# EAGLE design envlogger (EAGLE 9.6.1)

## Sheet 1 of 4
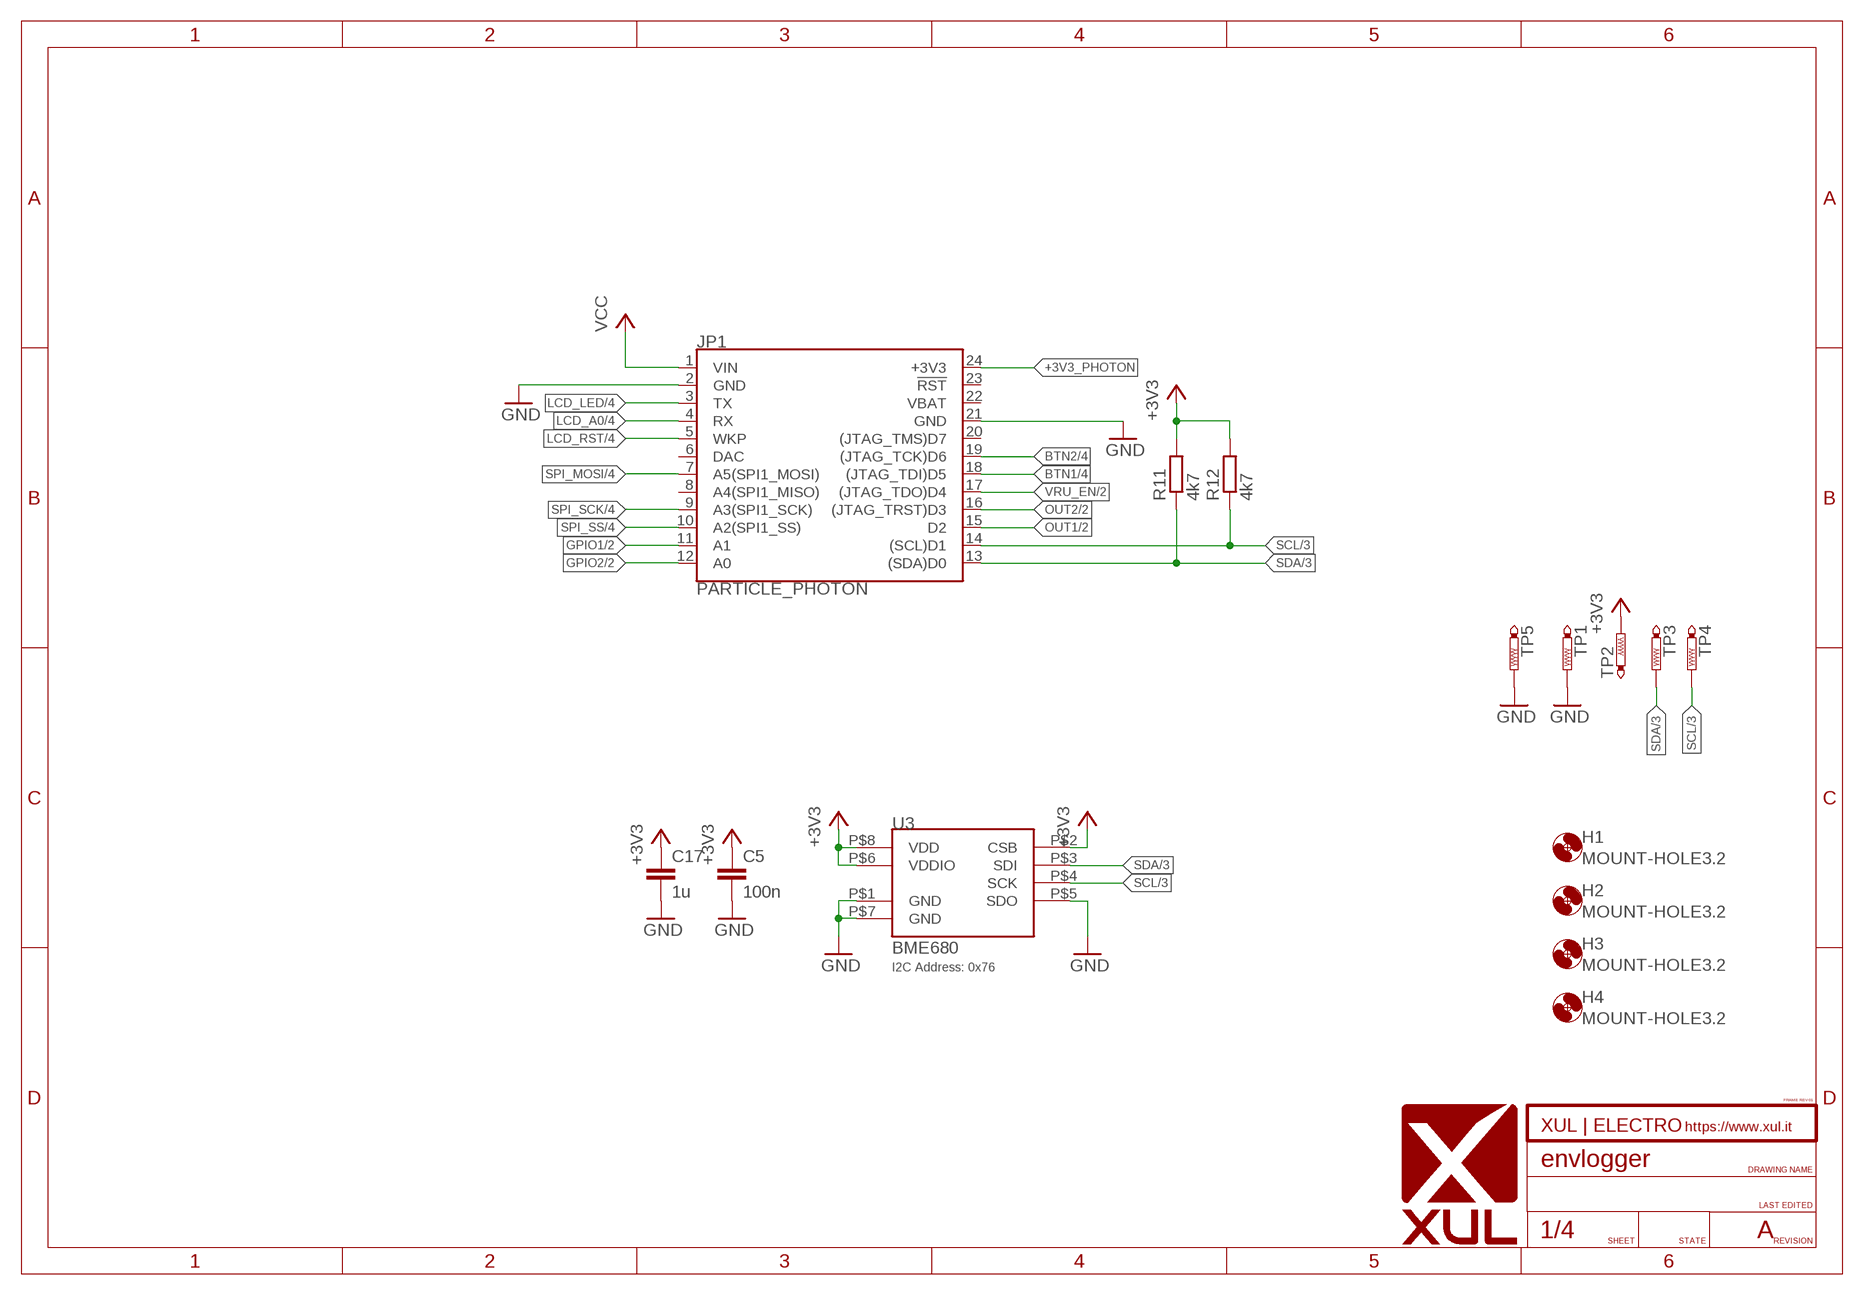
[diagram p0: schematic, sheet 1]
FRAME1 (FRAME-XUL-A4L-LOC): REV: A

### Parts
C5  100n  C-EUC0603  [C0603]
C17  1u  C-EUC0603  [C0603]
H1  MOUNT-HOLE3.2  [3,2]
H2  MOUNT-HOLE3.2  [3,2]
H3  MOUNT-HOLE3.2  [3,2]
H4  MOUNT-HOLE3.2  [3,2]
JP1  PARTICLE_PHOTON  [PARTICLE_PHOTON]
R11  4k7  R-EU_R0603  [R0603]
R12  4k7  R-EU_R0603  [R0603]
TP1  PTR1B1,27  [B1,27]
TP2  PTR1B1,27  [B1,27]
TP3  PTR1B1,27  [B1,27]
TP4  PTR1B1,27  [B1,27]
TP5  PTR1PAD1-13  [P1-13]
U3  BME680  [BME680]

### Nets
+3V3: C5.1 C17.1 R11.2 R12.2 TP2.TP U3.P$2(CSB) U3.P$6(VDDIO) U3.P$8(VDD) ; also sheet 2,3,4
+3V3_PHOTON: JP1.24(+3V3)
BTN1: JP1.18((JTAG_TDI)D5) ; also sheet 4
BTN2: JP1.19((JTAG_TCK)D6) ; also sheet 4
GND: C5.2 C17.2 JP1.2(GND) JP1.21(GND) TP1.TP TP5.TP U3.P$1(GND) U3.P$5(SDO) U3.P$7(GND) ; also sheet 2,3,4
GPIO1: JP1.11(A1) ; also sheet 2
GPIO2: JP1.12(A0) ; also sheet 2
LCD_A0: JP1.4(RX) ; also sheet 4
LCD_LED: JP1.3(TX) ; also sheet 4
LCD_RST: JP1.5(WKP) ; also sheet 4
OUT1: JP1.15(D2) ; also sheet 2
OUT2: JP1.16((JTAG_TRST)D3) ; also sheet 2
SCL: JP1.14((SCL)D1) R12.1 TP4.TP U3.P$4(SCK) ; also sheet 3
SDA: JP1.13((SDA)D0) R11.1 TP3.TP U3.P$3(SDI) ; also sheet 3
SPI_MOSI: JP1.7(A5(SPI1_MOSI)) ; also sheet 4
SPI_SCK: JP1.9(A3(SPI1_SCK)) ; also sheet 4
SPI_SS: JP1.10(A2(SPI1_SS)) ; also sheet 4
VCC: JP1.1(VIN) ; also sheet 2
VRU_EN: JP1.17((JTAG_TDO)D4) ; also sheet 2
Unconnected: JP1.6(DAC) JP1.8(A4(SPI1_MISO)) JP1.20((JTAG_TMS)D7) JP1.23(!RST!)

### Notes on the sheet
- I2C Address: 0x76

## Sheet 2 of 4
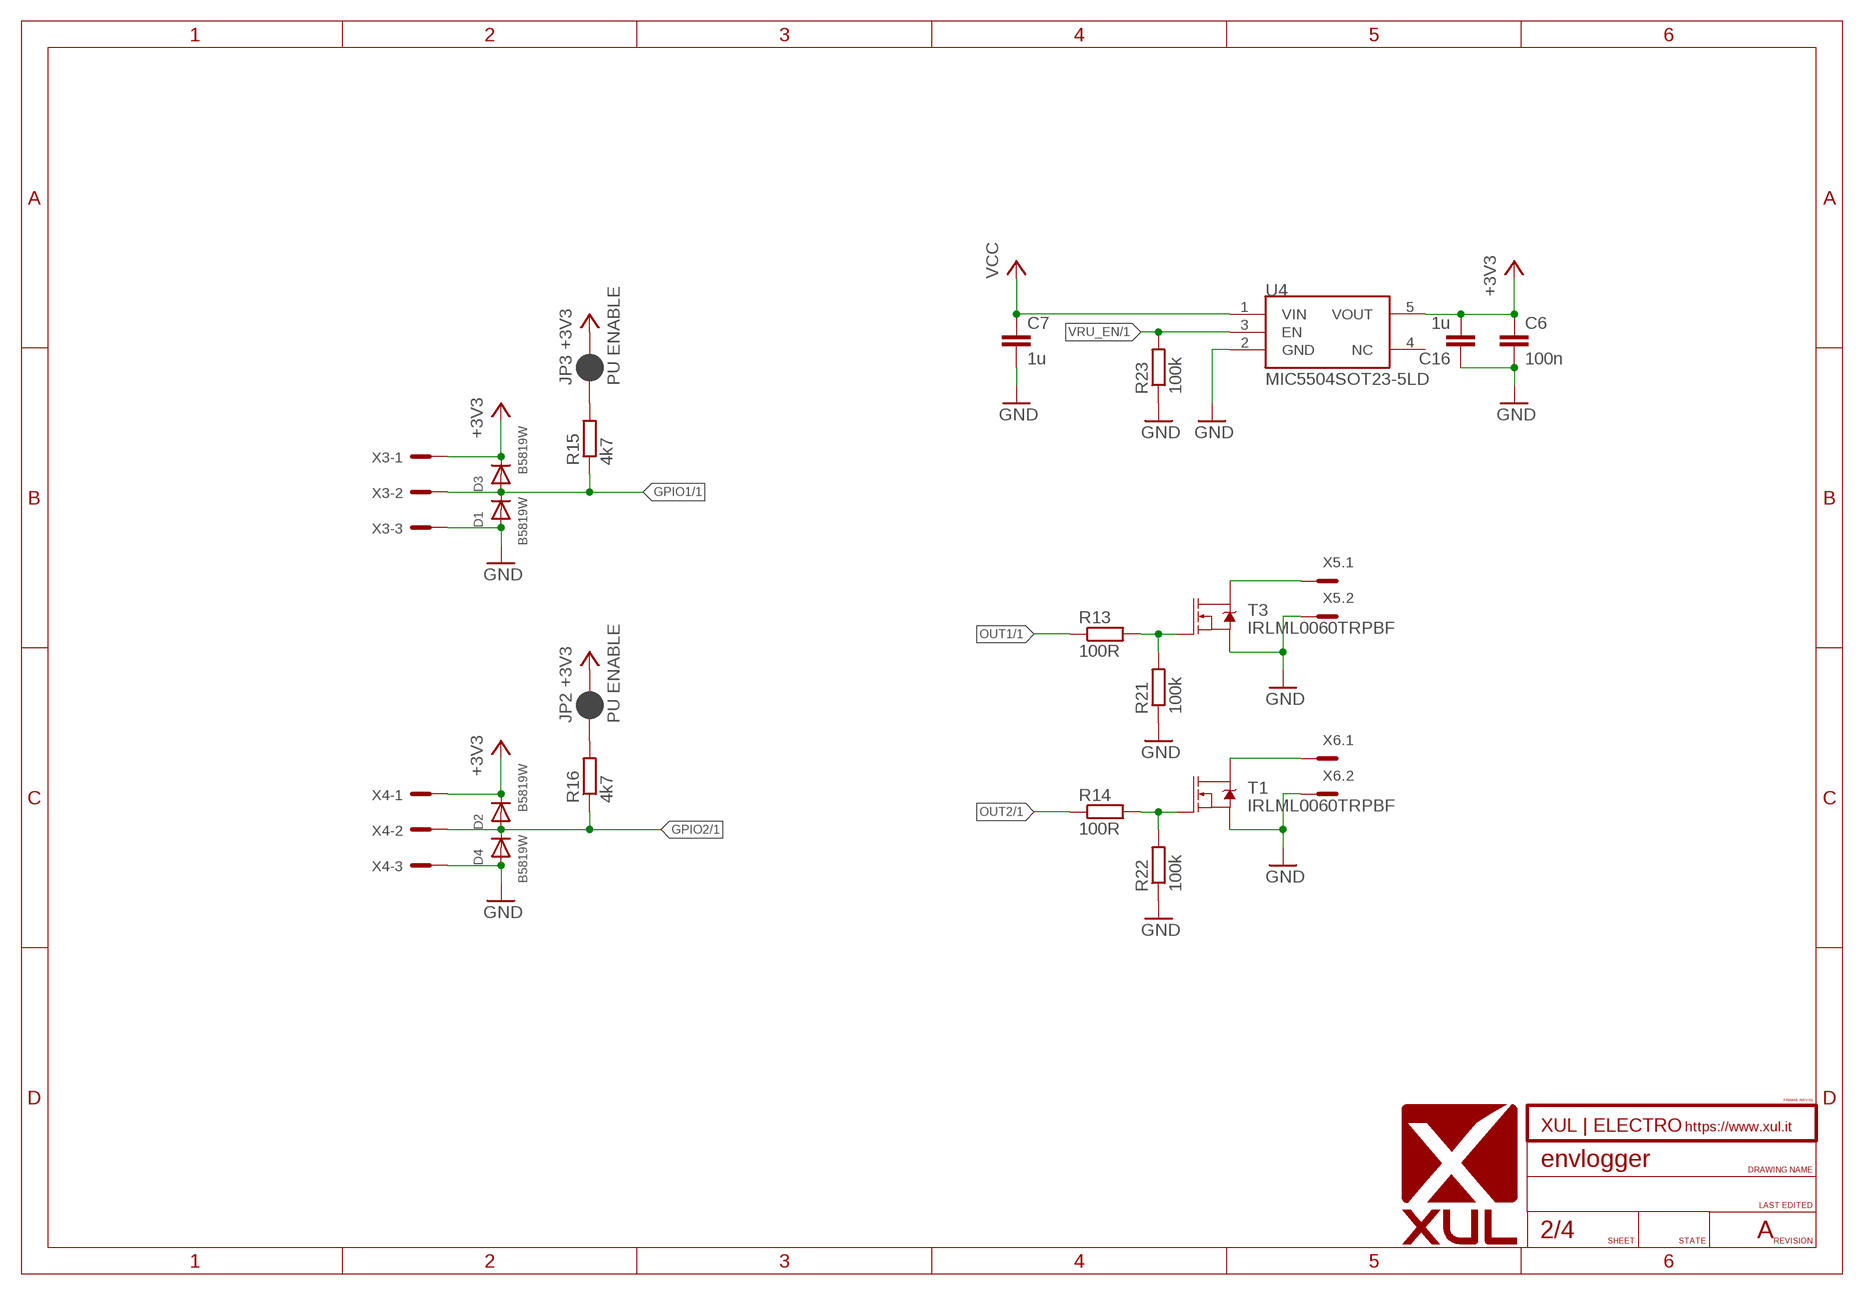
[diagram p1: schematic, sheet 2]
FRAME3 (FRAME-XUL-A4L-LOC): REV: A

### Parts
C6  100n  C-EUC0603  [C0603]
C7  1u  C-EUC0603  [C0603]
C16  1u  C-EUC0603  [C0603]
D1  B5819W  DIODESOD-123  [SOD-123]
D2  B5819W  DIODESOD-123  [SOD-123]
D3  B5819W  DIODESOD-123  [SOD-123]
D4  B5819W  DIODESOD-123  [SOD-123]
JP2  PU ENABLE  JUMPER-SMT_2_NC_PASTE_SILK  [SMT-JUMPER_2_NC_PASTE_SILK]
JP3  PU ENABLE  JUMPER-SMT_2_NC_PASTE_SILK  [SMT-JUMPER_2_NC_PASTE_SILK]
R13  100R  R-EU_R0603  [R0603]
R14  100R  R-EU_R0603  [R0603]
R15  4k7  R-EU_R0603  [R0603]
R16  4k7  R-EU_R0603  [R0603]
R21  100k  R-EU_R0603  [R0603]
R22  100k  R-EU_R0603  [R0603]
R23  100k  R-EU_R0603  [R0603]
T1  IRLML0060TRPBF  [SOT95P237X112-3N]
T3  IRLML0060TRPBF  [SOT95P237X112-3N]
U4  MIC5504SOT23-5LD  [SOT95P280X145-5]
X3  MCV_05/3-G-2,5  [MC3]
X4  MCV_05/3-G-2,5  [MC3]
X5  MC2  [MC2]
X6  MC2  [MC2]

### Nets
+3V3: C6.1 C16.2 D2.C D3.C JP2.2 JP3.2 U4.5(VOUT) X3.1 X4.1 ; also sheet 1,3,4
GND: C6.2 C7.2 C16.1 D1.A D4.A R21.1 R22.1 R23.1 T1.2(S) T3.2(S) U4.2(GND) X3.3 X4.3 X5.2 X6.2 ; also sheet 1,3,4
GPIO1: D1.C D3.A R15.1 X3.2 ; also sheet 1
GPIO2: D2.A D4.C R16.1 X4.2 ; also sheet 1
N$9: T3.3(D) X5.1
N$10: R13.2 R21.2 T3.1(G)
N$11: T1.3(D) X6.1
N$12: R14.2 R22.2 T1.1(G)
N$13: JP2.1 R16.2
N$14: JP3.1 R15.2
OUT1: R13.1 ; also sheet 1
OUT2: R14.1 ; also sheet 1
VCC: C7.1 U4.1(VIN) ; also sheet 1
VRU_EN: R23.2 U4.3(EN) ; also sheet 1
Unconnected: U4.4(NC)

## Sheet 3 of 4
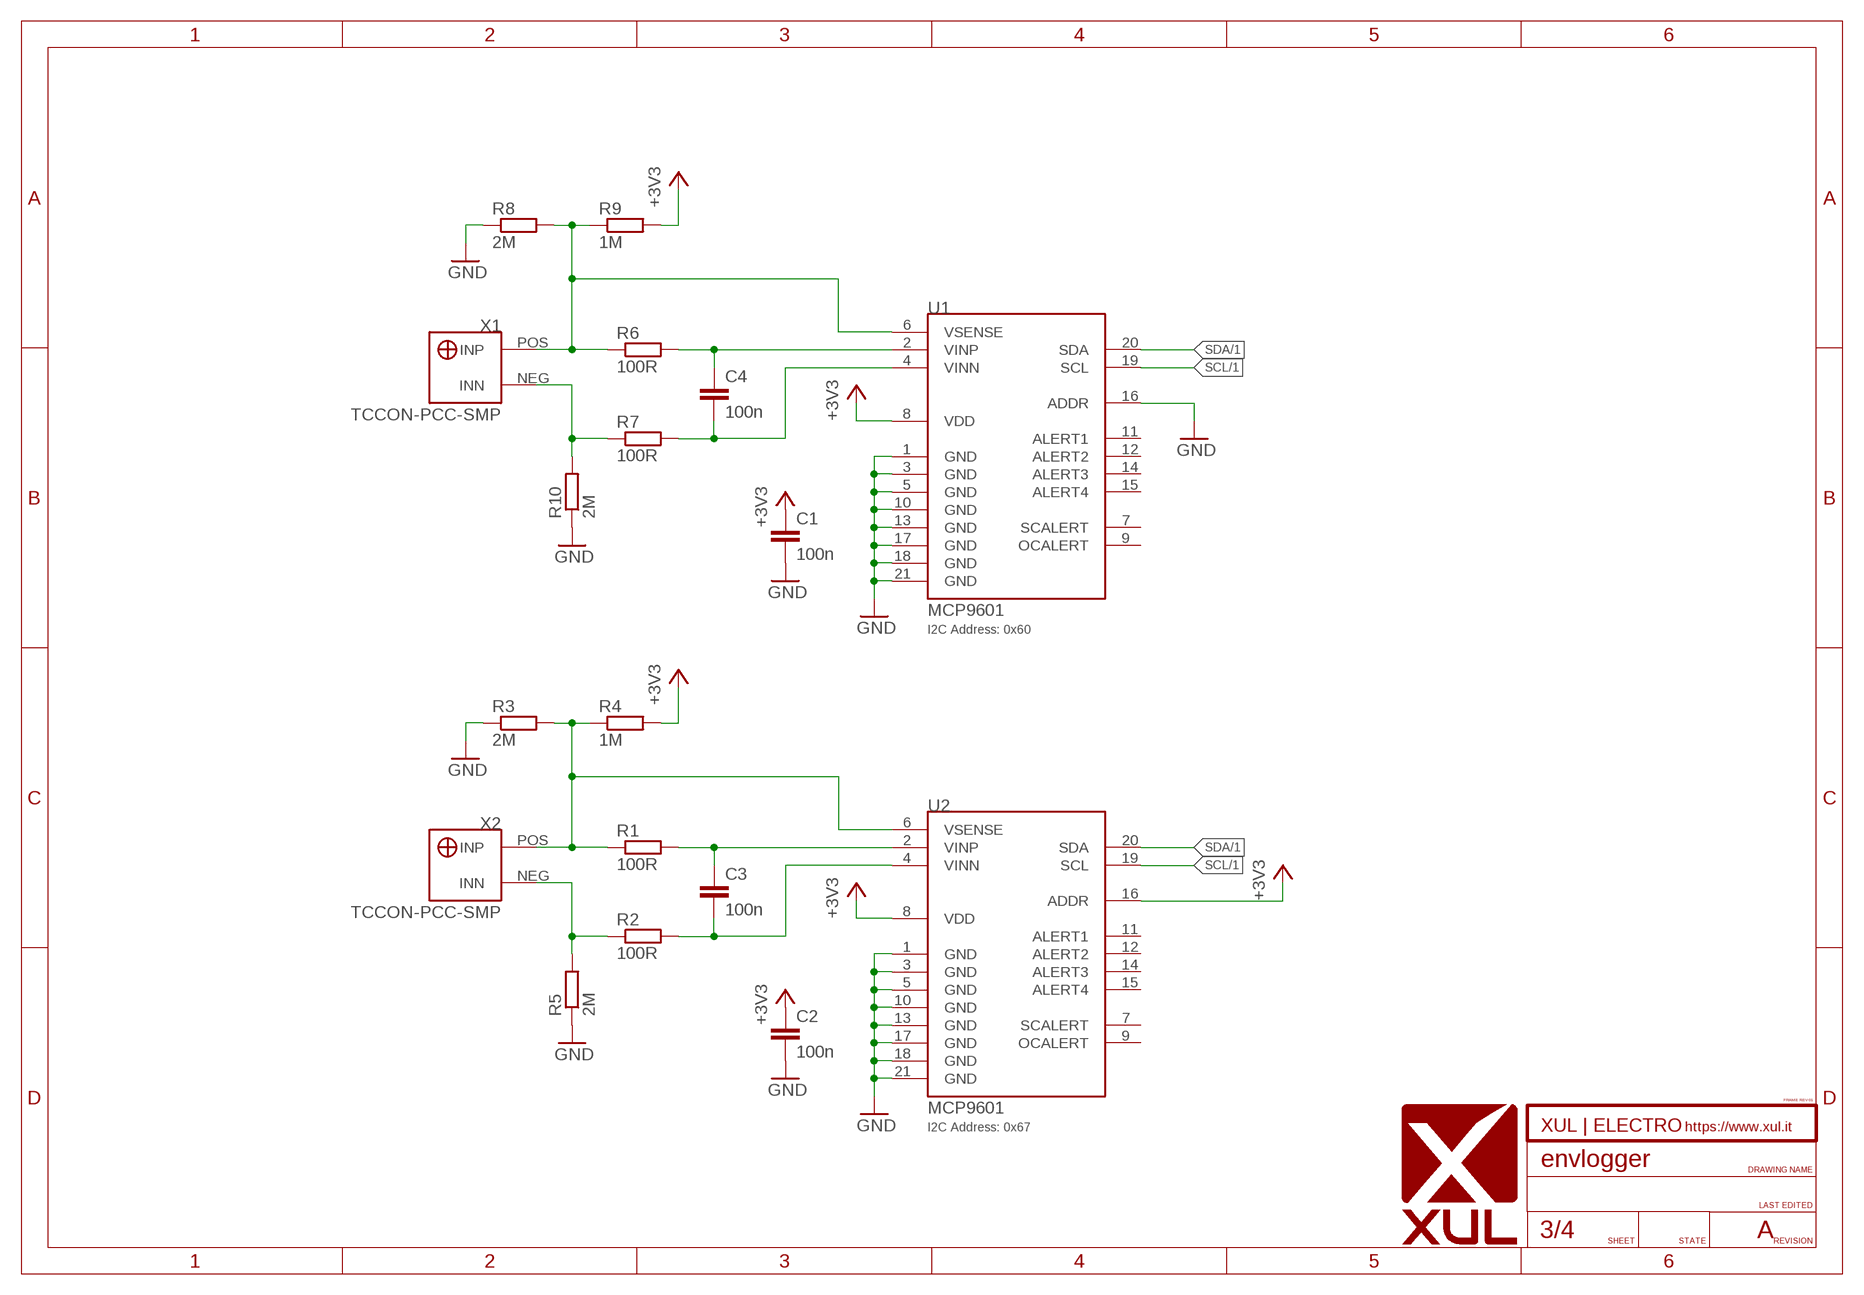
[diagram p2: schematic, sheet 3]
FRAME2 (FRAME-XUL-A4L-LOC): REV: A

### Parts
C1  100n  C-EUC0603  [C0603]
C2  100n  C-EUC0603  [C0603]
C3  100n  C-EUC0603  [C0603]
C4  100n  C-EUC0603  [C0603]
R1  100R  R-EU_R0603  [R0603]
R2  100R  R-EU_R0603  [R0603]
R3  2M  R-EU_R0603  [R0603]
R4  1M  R-EU_R0603  [R0603]
R5  2M  R-EU_R0603  [R0603]
R6  100R  R-EU_R0603  [R0603]
R7  100R  R-EU_R0603  [R0603]
R8  2M  R-EU_R0603  [R0603]
R9  1M  R-EU_R0603  [R0603]
R10  2M  R-EU_R0603  [R0603]
U1  MCP9601  [QFN65P500X500X95-21T325N]
U2  MCP9601  [QFN65P500X500X95-21T325N]
X1  TCCON-PCC-SMP  [TCCON-PCC-SMP]
X2  TCCON-PCC-SMP  [TCCON-PCC-SMP]

### Nets
+3V3: C1.1 C2.1 R4.2 R9.2 U1.8(VDD) U2.8(VDD) U2.16(ADDR) ; also sheet 1,2,4
GND: C1.2 C2.2 R3.1 R5.1 R8.1 R10.1 U1.1(GND) U1.3(GND) U1.5(GND) U1.10(GND) U1.13(GND) U1.16(ADDR) U1.17(GND) U1.18(GND) U1.21(GND) U2.1(GND) U2.3(GND) U2.5(GND) U2.10(GND) U2.13(GND) U2.17(GND) U2.18(GND) U2.21(GND) ; also sheet 1,2,4
N$1: R1.1 R3.2 R4.1 U2.6(VSENSE) X2.POS(INP)
N$2: R2.1 R5.2 X2.NEG(INN)
N$3: C3.2 R2.2 U2.4(VINN)
N$4: C3.1 R1.2 U2.2(VINP)
N$5: R6.1 R8.2 R9.1 U1.6(VSENSE) X1.POS(INP)
N$6: R7.1 R10.2 X1.NEG(INN)
N$7: C4.2 R7.2 U1.4(VINN)
N$8: C4.1 R6.2 U1.2(VINP)
SCL: U1.19(SCL) U2.19(SCL) ; also sheet 1
SDA: U1.20(SDA) U2.20(SDA) ; also sheet 1
Unconnected: U1.7(SCALERT) U1.9(OCALERT) U1.11(ALERT1) U1.12(ALERT2) U1.14(ALERT3) U1.15(ALERT4) U2.7(SCALERT) U2.9(OCALERT) U2.11(ALERT1) U2.12(ALERT2) U2.14(ALERT3) U2.15(ALERT4)

### Notes on the sheet
- I2C Address: 0x60
- I2C Address: 0x67

## Sheet 4 of 4
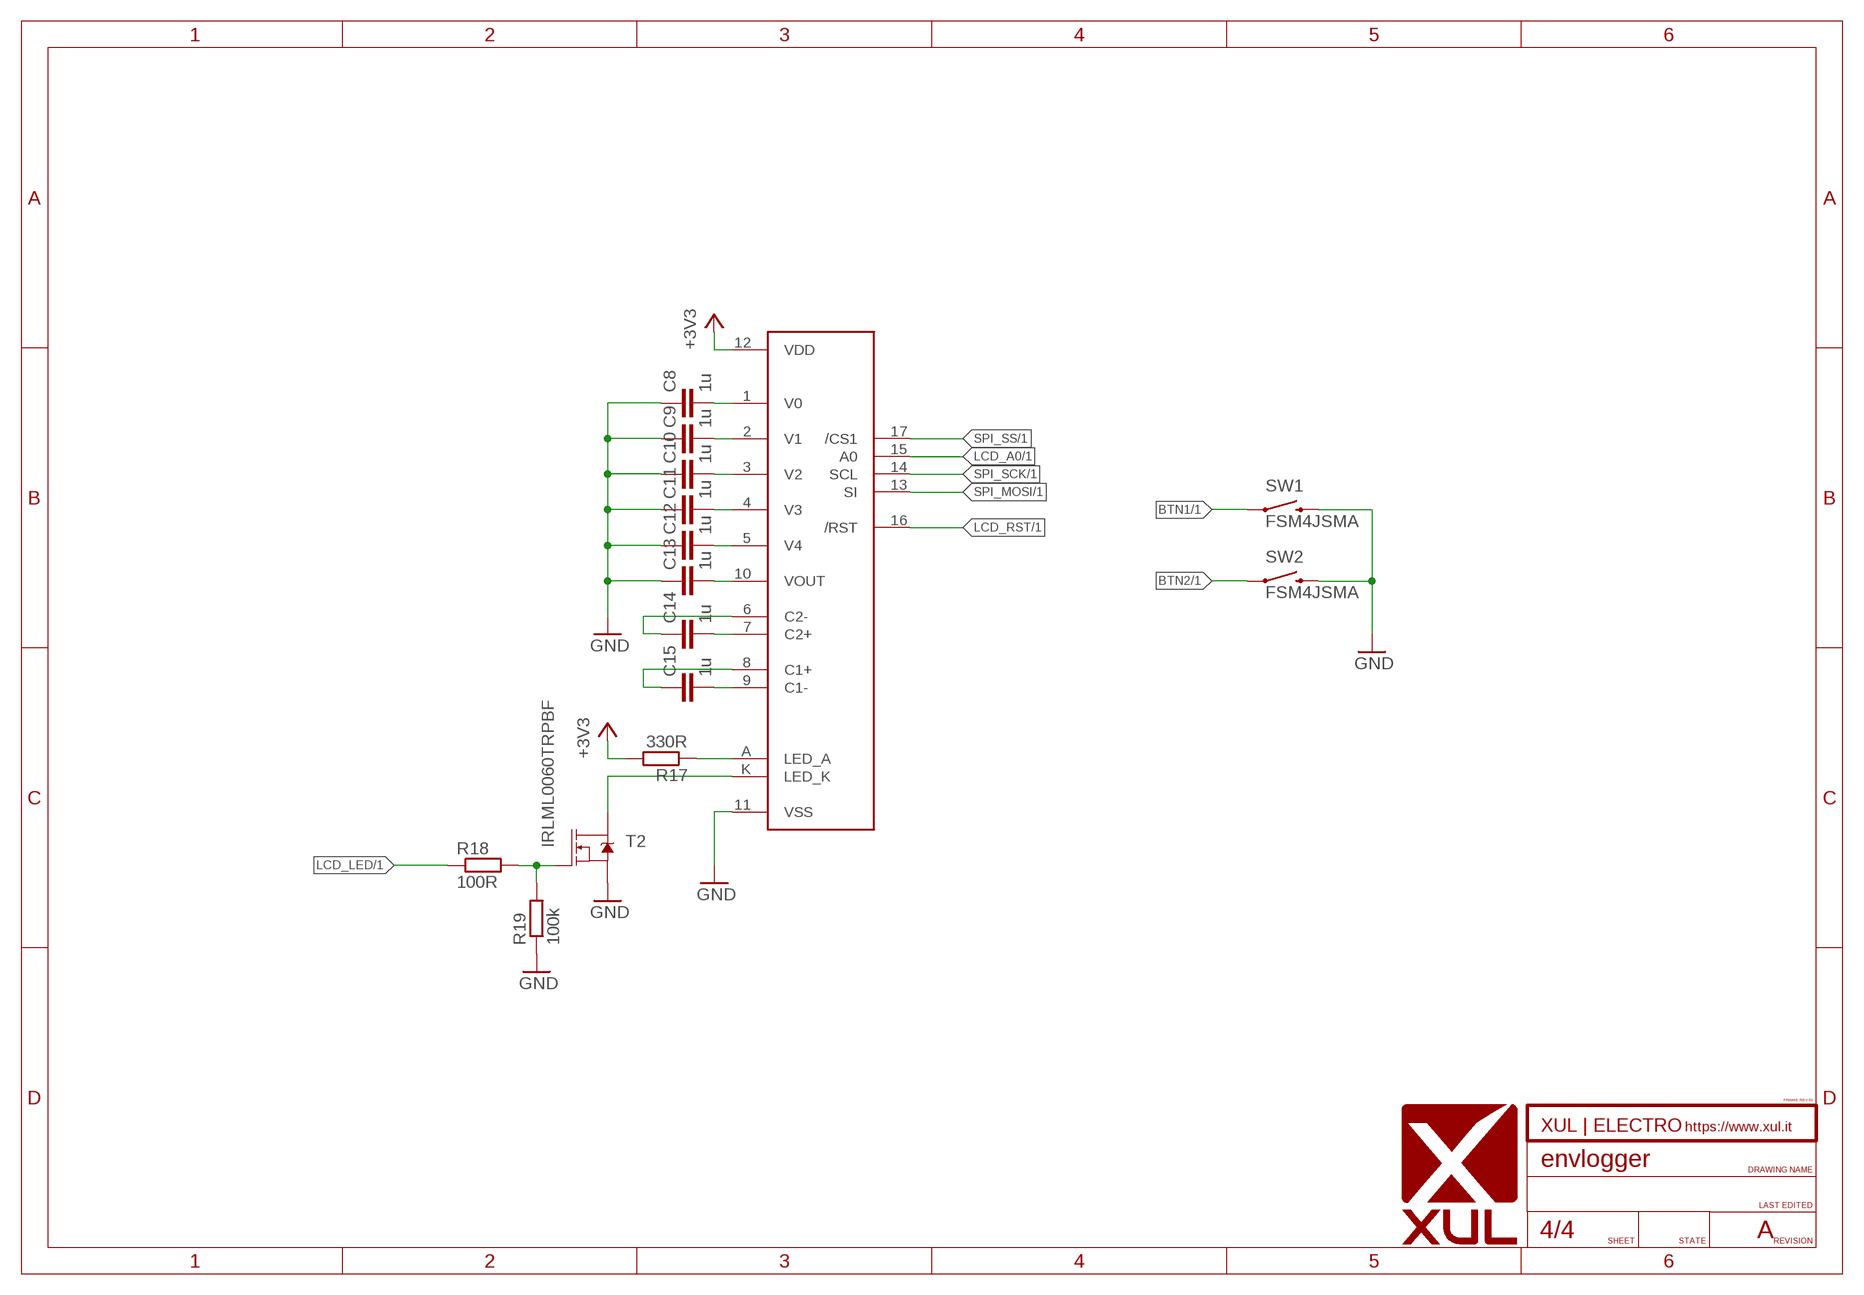
[diagram p3: schematic, sheet 4]
FRAME4 (FRAME-XUL-A4L-LOC): REV: A

### Parts
C8  1u  C-EUC0603  [C0603]
C9  1u  C-EUC0603  [C0603]
C10  1u  C-EUC0603  [C0603]
C11  1u  C-EUC0603  [C0603]
C12  1u  C-EUC0603  [C0603]
C13  1u  C-EUC0603  [C0603]
C14  1u  C-EUC0603  [C0603]
C15  1u  C-EUC0603  [C0603]
DISP1  NHD-C12832A1Z  [NHD-C12832A1Z]
R17  330R  R-EU_R0603  [R0603]
R18  100R  R-EU_R0603  [R0603]
R19  100k  R-EU_R0603  [R0603]
SW1  FSM4JSMA  [BUTTON-6MM-SPST]
SW2  FSM4JSMA  [BUTTON-6MM-SPST]
T2  IRLML0060TRPBF  [SOT95P237X112-3N]

### Nets
+3V3: DISP1.12(VDD) R17.2 ; also sheet 1,2,3
BTN1: SW1.P$1 ; also sheet 1
BTN2: SW2.P$1 ; also sheet 1
GND: C8.1 C9.1 C10.1 C11.1 C12.1 C13.1 DISP1.11(VSS) R19.1 SW1.P$4 SW2.P$4 T2.2(S) ; also sheet 1,2,3
LCD_A0: DISP1.15(A0) ; also sheet 1
LCD_LED: R18.1 ; also sheet 1
LCD_RST: DISP1.16(/RST) ; also sheet 1
N$15: DISP1.A(LED_A) R17.1
N$16: R18.2 R19.2 T2.1(G)
N$17: DISP1.K(LED_K) T2.3(D)
N$18: C8.2 DISP1.1(V0)
N$19: C9.2 DISP1.2(V1)
N$20: C10.2 DISP1.3(V2)
N$21: C11.2 DISP1.4(V3)
N$22: C12.2 DISP1.5(V4)
N$23: C13.2 DISP1.10(VOUT)
N$24: C14.2 DISP1.7(C2+)
N$25: C15.2 DISP1.9(C1-)
N$26: C14.1 DISP1.6(C2-)
N$27: C15.1 DISP1.8(C1+)
SPI_MOSI: DISP1.13(SI) ; also sheet 1
SPI_SCK: DISP1.14(SCL) ; also sheet 1
SPI_SS: DISP1.17(/CS1) ; also sheet 1

## Power pins joined to a net without a drawn wire
VBAT: JP1.22(VBAT)

## Library data of the parts
C1-C17 = resistor:C-EU: CAPACITOR, European symbol
D1-D4 = adafruit:DIODE: Diode SMADIODE - SMA Surface Mount Package 20V 1A Schottky Diode Digikey: 641-1014-6-ND DO-1N4148 - Through Hole Small Current Diode SOD-123 20V 1 A (.5mV Vf) Schottky Diode - Digikey: MBRX120TPMSCT-ND SOD-323 10V 570mA (.38mV Vf, 3ns) Schottky Diode - Digikey: ZLLS410CT-ND SOD-523 30V 30mA Schottky Diode (RB751S-40TE61) - Digikey: RB751S-40TE61CT-ND SOT23-R/W - SOT23 Package (R = Solder Paste/Reflow Ovens, W = Hand-Soldering) BAT54Film 40V 300mA - Digikey: 497-7162-1-ND
DISP1 = xul:NHD-C12832A1Z
H1-H4 = holes:MOUNT-HOLE: MOUNTING HOLE with drill center marker
JP1 = SparkFun-Boards:PARTICLE_PHOTON: Particle Photon Footprint of the Particle Photon that is used as a basis for many Photon shields. SparkFun Products: Particle Photon <https://www.sparkfun.com/products/13764> SparkFun Photon ProtoShield <https://www.sparkfun.com/products/13598> SparkFun Photon micro OLED Shield <https://www.sparkfun.com/products/13628> SparkFun Photon IMU Shield <https://www.sparkfun.com/products/13629> SparkFun Photon Battery Shield <https://www.sparkfun.com/products/13626>
JP2 JP3 = SparkFun-Jumpers:JUMPER-SMT_2_NC_PASTE: Normally closed solder jumper This jumper has an aperture in the stencil to allow solder paste to bridge the split in the wire so it's normally closed (NC). Wick off the solder to open the connection. Reapply solder to reclose the connection.
R1-R19 R21-R23 = resistor:R-EU_: RESISTOR, European symbol
SW1 SW2 = xul:FSM4JSMA: Tactile switch SPST-NO
T1-T3 = xul:IRLML0060TRPBF: N-Channel MOSFET Vdss=60V Id=2,7A RdsON=92mOhm @10V, 2,7A Vgsmax=+/-16V
TP1-TP5 = testpad:PTR1: TEST PIN
U1 U2 = xul:MCP9601: Thermocouple EMF to temperature converter
U3 = xul:BME680: Environmental sensor Gas (VOC), pressure, temperature, humidity
U4 = xul:MIC5504: LDO 3V3 300mA Input voltage: 2,5V-5,5V Iq=38uA Vdo=160mV @300mA
X1 X2 = xul:TCCON: Thermocouple cold junction IEC miniature connector
X3 X4 = con-phoenix-250:MCV_05/3-G-2,5: Mini-Combicon 2.50mm 3polig MC(V) 0,5/3-G-2,5
X5 X6 = con-phoenix-381_l:MC2: Mini-Combicon 3.81mm horizontal 2-polig MC 1,5/2-G-3,81 Artikel-Nr. 1803277

## Board
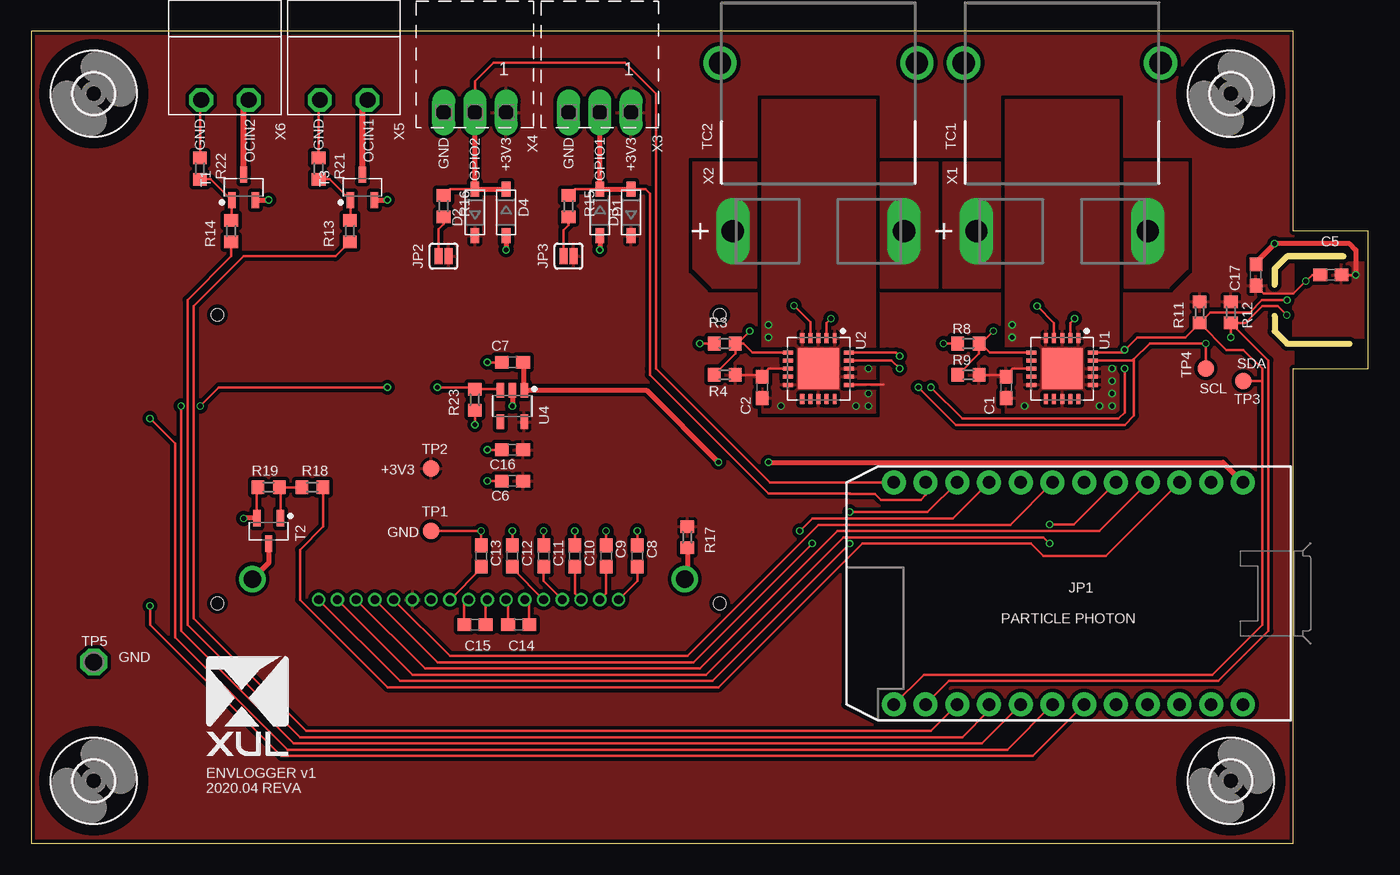
[diagram p4: board, top side]
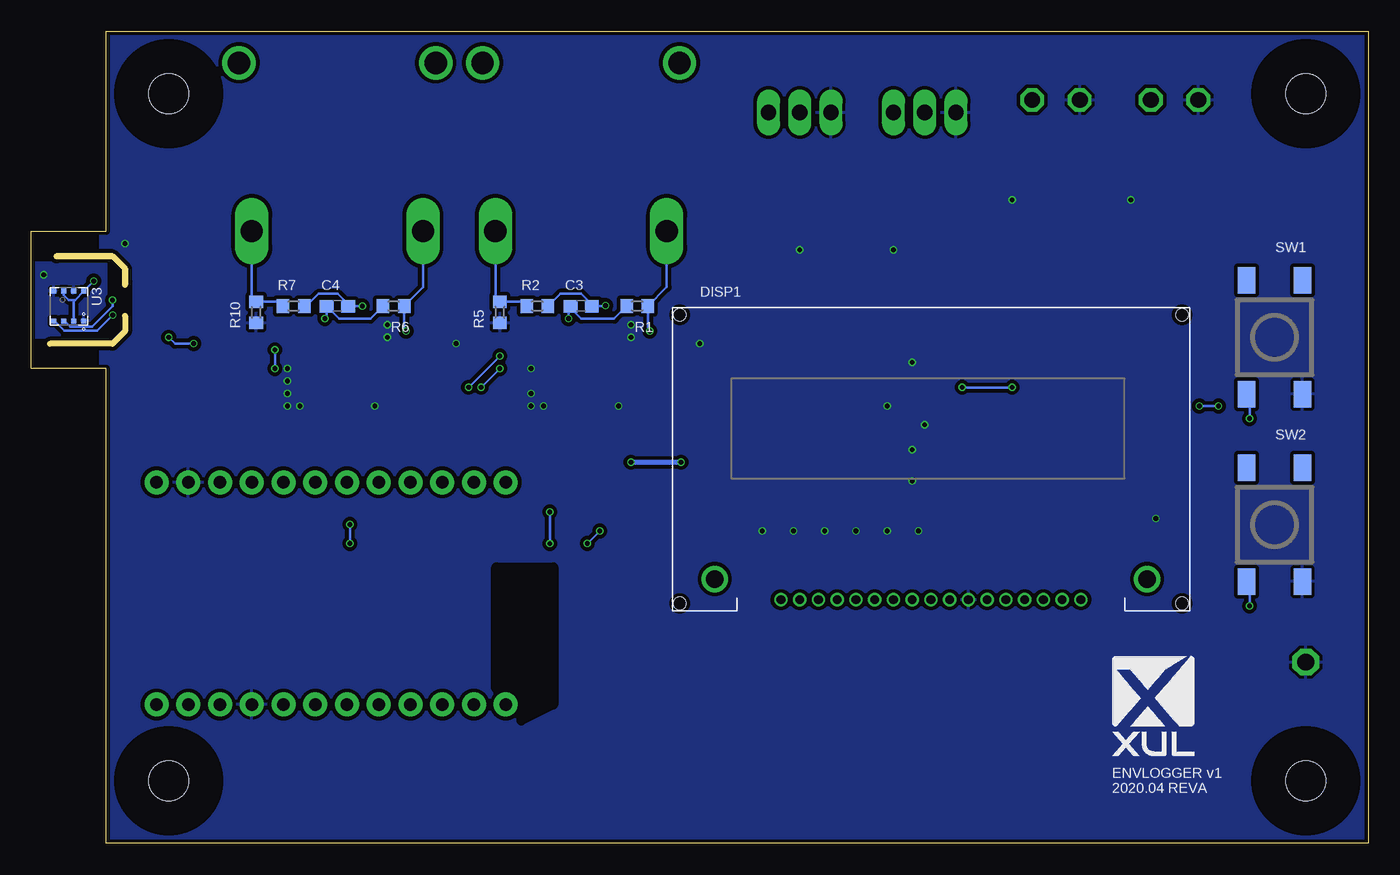
[diagram p5: board, bottom side, seen from below]

Size 107 x 65 mm. Coordinates in mm from the lower left corner, seen from the top.
Outline: 99.5,42.2 99.5,41 100.5,40 105.5,40
Outline: 99.5,44.7 99.5,46 100.5,47 105,47
Outline: 0,0 101,0 101,38 107,38 107,49 101,49 101,65 0,65 0,0
Copper layers (1*16): Top 0.035559375mm / dielectric 1.6mm / Bottom 0.035559375mm
Design rules "jlcpcb2layer-ext": minimum track width 5mil, minimum drill 12mil, track to track 5mil, track to pad 5mil, pad to pad 5mil, via to via 5mil, smd to smd 5mil, copper to edge 8mil, drill to drill 6mil, minimum pad ring 5mil, minimum via ring 3mil, stop-mask expansion 2.5mil, vias tented up to drill 0mil, thermal gap 10mil
Milling: 6 lines

### Footprints (pad centres in the part's own frame; a part is rotated, then mirrored left to right if it is on the bottom)
C0603 = smd 1.1 x 1: 1 -0.85,0; 2 0.85,0
SOD-123 = smd 1.2 x 0.7: A 1.85,0; C -1.85,0
NHD-C12832A1Z = drill 0.7: 1 0,0; 2 1.5,0; 3 3,0; 4 4.5,0; 5 6,0; 6 7.5,0; 7 9,0; 8 10.5,0; 9 12,0; 10 13.5,0; 11 15,0; 12 16.5,0; 13 18,0; 14 19.5,0; 15 21,0; 16 22.5,0; 17 24,0 | drill 1.4: A -5.3,1.65; K 29.3,1.65 | hole 1: -8.1,-0.3; 32.1,-0.3; -8.1,22.8; 32.1,22.8
3,2 = hole 3.2: 0,0
PARTICLE_PHOTON = drill 1.016 pad 1.905: 1 -8.89,13.97; 2 -8.89,11.43; 3 -8.89,8.89; 4 -8.89,6.35; 5 -8.89,3.81; 6 -8.89,1.27; 7 -8.89,-1.27; 8 -8.89,-3.81; 9 -8.89,-6.35; 10 -8.89,-8.89; 11 -8.89,-11.43; 12 -8.89,-13.97; 13 8.89,-13.97; 14 8.89,-11.43; 15 8.89,-8.89; 16 8.89,-6.35; 17 8.89,-3.81; 18 8.89,-1.27; 19 8.89,1.27; 20 8.89,3.81; 21 8.89,6.35; 22 8.89,8.89; 23 8.89,11.43; 24 8.89,13.97
SMT-JUMPER_2_NC_PASTE_SILK = smd 0.635 x 1.27: 1 -0.406,0; 2 0.406,0
R0603 = smd 1 x 1.1: 1 -0.85,0; 2 0.85,0
BUTTON-6MM-SPST = smd 1.397 x 2.108: P$1 2.235,4.547; P$2 2.235,-4.547; P$3 -2.235,-4.547; P$4 -2.235,4.547
SOT95P237X112-3N = smd 1.298 x 0.589: 1 -1.027,0.95; 2 -1.027,-0.95; 3 1.027,0
B1,27 = smd 1.27 x 1.27: TP 0,0
P1-13 = drill 1.321 pad 2.159 octagon: TP 0,0
QFN65P500X500X95-21T325N = smd 0.811 x 0.32: 1 -2.451,1.3; 2 -2.451,0.65; 3 -2.451,0; 4 -2.451,-0.65; 5 -2.451,-1.3; 11 2.451,-1.3; 12 2.451,-0.65; 13 2.451,0; 14 2.451,0.65; 15 2.451,1.3 | smd 0.32 x 0.811: 6 -1.3,-2.451; 7 -0.65,-2.451; 8 0,-2.451; 9 0.65,-2.451; 10 1.3,-2.451; 16 1.3,2.451; 17 0.65,2.451; 18 0,2.451; 19 -0.65,2.451; 20 -1.3,2.451 | smd 3.25 x 3.25: 21 0,0
BME680 = smd 0.4 x 0.4: P$1 1.2,1.2; P$2 1.2,0.4; P$3 1.2,-0.4; P$4 1.2,-1.2; P$5 -1.2,-1.2; P$6 -1.2,-0.4; P$7 -1.2,0.4; P$8 -1.2,1.2
SOT95P280X145-5 = smd 1.186 x 0.593: 1 -1.264,0.95; 2 -1.264,0; 3 -1.264,-0.95; 4 1.264,-0.95; 5 1.264,0.95
TCCON-PCC-SMP = drill 1.778 long: NEG 0,-6.858; POS 0,6.858 | drill 1.778: P$3 13.462,7.874; P$4 13.462,-7.874
MC3 = drill 1.22 pad 1.676 long: 1 -2.5,0; 2 0,0; 3 2.5,0
MC2 = drill 1.27 octagon: 1 -1.905,0; 2 1.905,0

### Placement (x,y rotation side)
C1  78,36.5 270 top
C2  58.5,36.5 270 top
C3  63,43 0 bottom
C4  82.5,43 0 bottom
C5  104,45.5 0 top
C6  38.5,31.5 180 top
C7  38.5,38.5 180 top
C8  48.5,23 270 top
C9  46,23 270 top
C10  43.5,23 270 top
C11  41,23 270 top
C12  38.5,23 270 top
C13  36,23 270 top
C14  39,17.5 180 top
C15  35.5,17.5 180 top
C16  38.5,29 0 top
C17  98,45.5 90 top
D1  45.5,50.5 270 top
D2  35.5,50.5 90 top
D3  48,50.5 90 top
D4  38,50.5 270 top
DISP1  47,19.5 0 bottom
H1  96,5 0 top
H2  96,60 0 top
H3  5,60 0 top
H4  5,5 0 top
JP1  83,20 270 top
JP2  33,47 0 top
JP3  43,47 0 top
R1  58.5,43 180 bottom
R2  66.5,43 0 bottom
R3  55.5,40 0 top
R4  55.5,37.5 0 top
R5  69.5,42.5 90 bottom
R6  78,43 180 bottom
R7  86,43 0 bottom
R8  75,40 0 top
R9  75,37.5 0 top
R10  89,42.5 90 bottom
R11  93.5,42.5 90 top
R12  96,42.5 90 top
R13  25.5,49 90 top
R14  16,49 90 top
R15  43,51 270 top
R16  33,51 270 top
R17  52.5,24.5 90 top
R18  22.5,28.5 180 top
R19  19,28.5 0 top
R21  23,54 270 top
R22  13.5,54 270 top
R23  35.5,35.5 90 top
SW1  7.5,40.5 180 bottom
SW2  7.5,25.5 180 bottom
T1  17,52.5 90 top
T2  19,25 270 top
T3  26.5,52.5 90 top
TP1  32,25 0 top
TP2  32,30 0 top
TP3  97,37 0 top
TP4  94,38 0 top
TP5  5,14.5 0 top
U1  82.5,38 270 top
U2  63,38 270 top
U3  104,43 270 bottom
U4  38.5,35 270 top
U$1  [XUL-LOGO-8MMH]  20.5,15 0 bottom
U$2  [XUL-LOGO-8MMH]  14,15 0 top
X1  82.5,49 90 top
X2  63,49 90 top
X3  45.5,58.5 180 top
X4  35.5,58.5 180 top
X5  25,59.5 180 top
X6  15.5,59.5 180 top

### Tracks (layer width: path | path; a pad name or v marks a point on that pad's centre or on a via)
+3V3  (via drill 0.38)
  Top 0.2: U2.8 59,38 58.5,37.5 C2.1 58.42,37.42 | 58.42,37.42 58.35,37.5 | 77.85,37.5 77.92,37.42 | 77.92,37.42 C1.1 | U1.8 78.5,38 77.92,37.42 | C5.1 102.5,45.5 v102,45 101,44 98.65,44 C17.1 | R4.2 58.35,37.5 | 58.35,37.5 58.42,37.42 | R9.2 77.85,37.5 | 77.85,37.5 77.92,37.42 | U2.16 68.2,36.7
  Bottom 0.2: 103.5,43.5 U3.P$8 v102,45 | 103.5,43.5 104,43.5 104.4,43.9 U3.P$6 | U3.P$2 103.6,43.4 103.5,43.5
  pour Top (isolate 0.305, rank 5): 0,0 101,0 101,65 0,65
BTN1  (via drill 0.38)
  Top 0.2: v9.5,34 11.5,32 11.5,16.5 20.5,7.5 78.12,7.5 JP1.18
  Bottom 0.2: SW1.P$1 9.5,35.72 v9.5,34
BTN2  (via drill 0.38)
  Top 0.2: v9.5,19 9.5,17.5 20,7 80.16,7 JP1.19
  Bottom 0.2: SW2.P$1 9.5,20.72 v9.5,19
GND  (via drill 0.38)
  Top 0.2: R22.1 13.5,59.41 X6.2 | R21.1 23,59.41 X5.2 | C5.2 v106,45.5 | C17.2 98,46.5 | C16.1 v36.5,29 | C6.2 v36.5,31.5 | R23.1 v35.5,33.5 | C7.2 v36.5,38.5 | T2.2 18.05,28.4 R19.1 | C13.1 v36,25 TP1.TP | C12.1 v38.5,25 | C11.1 v41,25 | C10.1 v43.5,25 | C9.1 v46,25 | C8.1 v48.5,25 | R3.1 v53.5,40 | R8.1 v73,40 | T1.2 17.98,51.5 | T3.2 27.48,51.5
  Top 0.4: v106,45.5 106,47.5 105.5,48 v99.5,48 98,46.5 | U4.2 v38.5,35 | T2.2 17.03,26.03 v17,26 | D1.A v45.5,47.5 | D4.A v38,47.5 | 17.98,51.5 v19,51.5 | 27.48,51.5 v28.5,51.5
  other vias: 59,41.5 59,40.5 66,35 67,35 78.5,41.5 85.5,35 86.5,35 78.5,40.5 67,36 67,38 86.5,36 86.5,38 86.5,37 60,35 79.5,35
  pour Top (isolate 0.305): 58.5,34.5 67.5,34.5 67.5,59.5 58.5,59.5
  pour Top (isolate 0.305): 78,59.5 78,34.5 87,34.5 87,59.5
  pour Top (isolate 0.305): 101,46.5 101,40.5 107.5,40.5 107.5,46.5
  pour Bottom (isolate 0.305): 0,0 0,65.5 101.5,65.5 101.5,0
  pour Bottom (isolate 0.305, rank 5): 101,46.5 101,40.5 107.5,40.5 107.5,46.5
  cutout Bottom (isolate 0.305): 99,44.5 99,42 100,42 100,45 99,45
GPIO1
  Top 0.2: R15.1 43.5,52.35 D1.C | D3.A 49.15,52.35 49.5,52 49.5,38 49.5,37.5 59,28 59.5,28 65.5,28 65.54,27.96 67.54,27.96 68,27.5 71.18,27.5 71.57,27.89 JP1.11
  Top 0.4: X3.2 D1.C D3.A
GPIO2
  Top 0.2: R16.1 33.5,52.35 D2.A | X4.2 35.5,61 37,62.5 47.5,62.5 50,60 50,38 59.11,28.89 JP1.12
  Top 0.4: X4.2 D2.A D4.C
LCD_A0
  Top 0.2: DISP1.15 31.5,14 53.5,14 64.5,25 85.46,25 JP1.4
LCD_LED
  Top 0.2: R18.1 23.35,25.35 21.5,23.5 21.5,19.5 28.5,12.5 55,12.5 66.5,24 80,24 81,23 86,23 JP1.3
LCD_RST  (via drill 0.38)
  Top 0.2: DISP1.16 30.5,13.5 54,13.5 65,24.5 81,24.5 v81.5,24 | v81.5,25.51 83.43,25.51 JP1.5
  Bottom 0.2: v81.5,24 v81.5,25.51
N$1  (via drill 0.38)
  Top 0.2: v57.5,41 56.5,40 | 56.5,40 R3.2 56.35,39.2 R4.1 | U2.6 57.7,39.3 57,40 56.5,40
  Bottom 0.2: X2.POS 56.14,44.51 R1.1 57.65,41.15 v57.5,41
  pour Top (isolate 0.305, no thermals): 54.5,44.5 58,44.5 58,54.5 53,54.5 53,46
N$2
  Bottom 0.2: R2.1 67.7,43.35 R5.2 69.86,43.71 X2.NEG
  pour Top (isolate 0.305, no thermals): 68,44.5 72.5,44.5 72.5,54.5 68,54.5
N$3  (via drill 0.38)
  Top 0.2: U2.4 62.35,41.73 v61.04,43.04
  Bottom 0.2: R2.2 64.65,44 63,44 62.15,43.15 C3.2 61.08,43 v61.04,43.04
N$4  (via drill 0.38)
  Top 0.2: U2.2 63.65,41.65 v64,42
  Bottom 0.2: R1.2 60.35,42 63,42 63.85,42.85 | 63.85,42.85 C3.1 | v64,42 64,42.7 63.85,42.85
N$5  (via drill 0.38)
  Top 0.2: v77,41 76,40 | 76,40 R8.2 75.85,39.2 R9.1 | U1.6 76.7,39.3 76,40
  Bottom 0.2: X1.POS 75.64,44.51 R6.1 77.15,41.15 v77,41
  pour Top (isolate 0.305, no thermals): 77.5,44.5 73,44.5 73,54.5 77.5,54.5
N$6
  Bottom 0.2: X1.NEG 89.36,43.71 R10.2 87.2,43.35 R7.1
  pour Top (isolate 0.305, no thermals): 87.5,44.5 87.5,54.5 92.5,54.5 92.5,46 91,44.5
N$7  (via drill 0.38)
  Top 0.2: U1.4 81.85,41.65 v80.5,43
  Bottom 0.2: R7.2 85,43 84,44 82.5,44 81.65,43.15 C4.2 v80.5,43
N$8  (via drill 0.38)
  Top 0.2: v83.5,42 83.15,41.65 U1.2
  Bottom 0.2: v83.5,42 83.35,42.15 C4.1 82.35,42 79.85,42 R6.2
N$9
  Top 0.5: T3.3 26.5,59.09 X5.1
N$10
  Top 0.2: R21.2 23.87,53.15 T3.1 25.55,49.9 R13.2
N$11
  Top 0.5: T1.3 17,59.09 X6.1
N$12
  Top 0.2: R22.2 14.37,53.15 T1.1 16.05,49.9 R14.2
N$13
  Top 0.2: JP2.1 32.59,49.14 33,49.55 R16.2
N$14
  Top 0.2: JP3.1 42.59,49.09 43,49.5 R15.2
N$15
  Top 0.4: R17.1 52.5,21.35 DISP1.A
N$16
  Top 0.2: T2.1 19.95,28.4 R19.2 R18.2
N$17
  Top 0.4: T2.3 19,22.45 DISP1.K
N$18
  Top 0.2: C8.2 48.5,21 DISP1.1
N$19
  Top 0.2: C9.2 46,20 DISP1.2
N$20
  Top 0.2: DISP1.3 43.5,20 C10.2
N$21
  Top 0.2: C11.2 41,21 DISP1.4
N$22
  Top 0.2: C12.2 38.5,22 DISP1.5
N$23
  Top 0.2: C13.2 36,22 DISP1.10
N$24
  Top 0.2: C14.2 38.15,19.35 DISP1.7
N$25
  Top 0.2: C15.2 34.65,19.15 DISP1.9
N$26
  Top 0.2: C14.1 39.85,19.15 DISP1.6
N$27
  Top 0.2: C15.1 36.35,19.35 DISP1.8
OUT1
  Top 0.2: R13.1 24.35,47 17,47 13,43 13,18 22,9 72,9 JP1.15
OUT2
  Top 0.2: R14.1 16,47 12.5,43.5 12.5,17.5 21.5,8.5 74.5,8.5 76.65,10.65 JP1.16
SCL  (via drill 0.38)
  Top 0.2: v100.47,42.29 99.76,43 98.5,43 97.15,41.65 R12.1 | JP1.14 73.46,13 95,13 99,17 99,38.65 R12.1 | U1.19 88.15,38.65 88.25,38.75 | 88.25,38.75 89.5,40 v94,40 TP4.TP | v96,40.5 R12.1 | U2.19 68.85,38.65 v69.5,38 | 88.25,38.75 88.25,34.25 87.5,33.5 74,33.5 v71,36.5
  Bottom 0.2: U3.P$4 105.12,41.8 104.37,41.05 101.72,41.05 v100.47,42.29 | v94,40 95.5,40 v96,40.5 | v69.5,38 v71,36.5
SDA  (via drill 0.38)
  Top 0.2: v100.5,43.49 98.49,43.49 97.5,42.5 94.35,42.5 R11.1 | JP1.13 71.42,13.5 94.5,13.5 98.5,17.5 98.5,37 | 98.5,37 98.5,38 97,39.5 95.65,39.5 R11.1 | R11.1 92.35,40.5 88.5,40.5 v87.5,39.5 87.3,39.3 U1.20 | U2.20 68.5,39.3 69.2,39.3 v69.5,39 | v87.5,38 87.5,34.5 87,34 74.5,34 v72,36.5 | TP3.TP 98.5,37
  Bottom 0.2: U3.P$3 104.32,41.8 103.89,41.37 102.11,41.37 100.5,42.99 v100.5,43.49 | v87.5,38 v87.5,39.5 | v69.5,39 v72,36.5
SPI_MOSI
  Top 0.2: DISP1.13 33.5,15 52.5,15 63,25.5 78.34,25.5 JP1.7
SPI_SCK  (via drill 0.38)
  Top 0.2: DISP1.14 32.5,14.5 53,14.5 v62.5,24 | v61.5,25 62.5,26 73.76,26 JP1.9
  Bottom 0.2: v62.5,24 v61.5,25
SPI_SS  (via drill 0.38)
  Top 0.2: DISP1.17 29.5,13 54.51,13 v65.5,23.99 | v65.5,26.51 71.73,26.51 JP1.10
  Bottom 0.2: v65.5,23.99 v65.5,26.51
VCC  (via drill 0.38)
  Top 0.2: 39.45,38.4 C7.1
  Top 0.4: 39.45,38.4 U4.1 49.24,36.26 v55,30.5 | v59,30.5 95.36,30.5 JP1.1
  Bottom 0.4: v55,30.5 v59,30.5
VRU_EN  (via drill 0.38)
  Top 0.2: U4.3 37.46,36.35 R23.2 35.35,36.5 v32.5,36.5 | v11.99,35 11.99,17.01 21,8 76.08,8 JP1.17 | v28.5,36.5 15.01,36.5 v13.51,35
  Bottom 0.2: v13.51,35 v11.99,35 | v32.5,36.5 v28.5,36.5

### Text on the board
tPlace: GND | OCIN2 | GND | OCIN1 | GND | GPIO2 | +3V3 | GND | GPIO1 | +3V3 | TC2 | TC1 | SDA | SCL | +3V3 | GND | PARTICLE PHOTON | GND | ENVLOGGER v1 / 2020.04 REVA
bPlace: ENVLOGGER v1 / 2020.04 REVA